# EAGLE design fp2o (EAGLE 5.04)
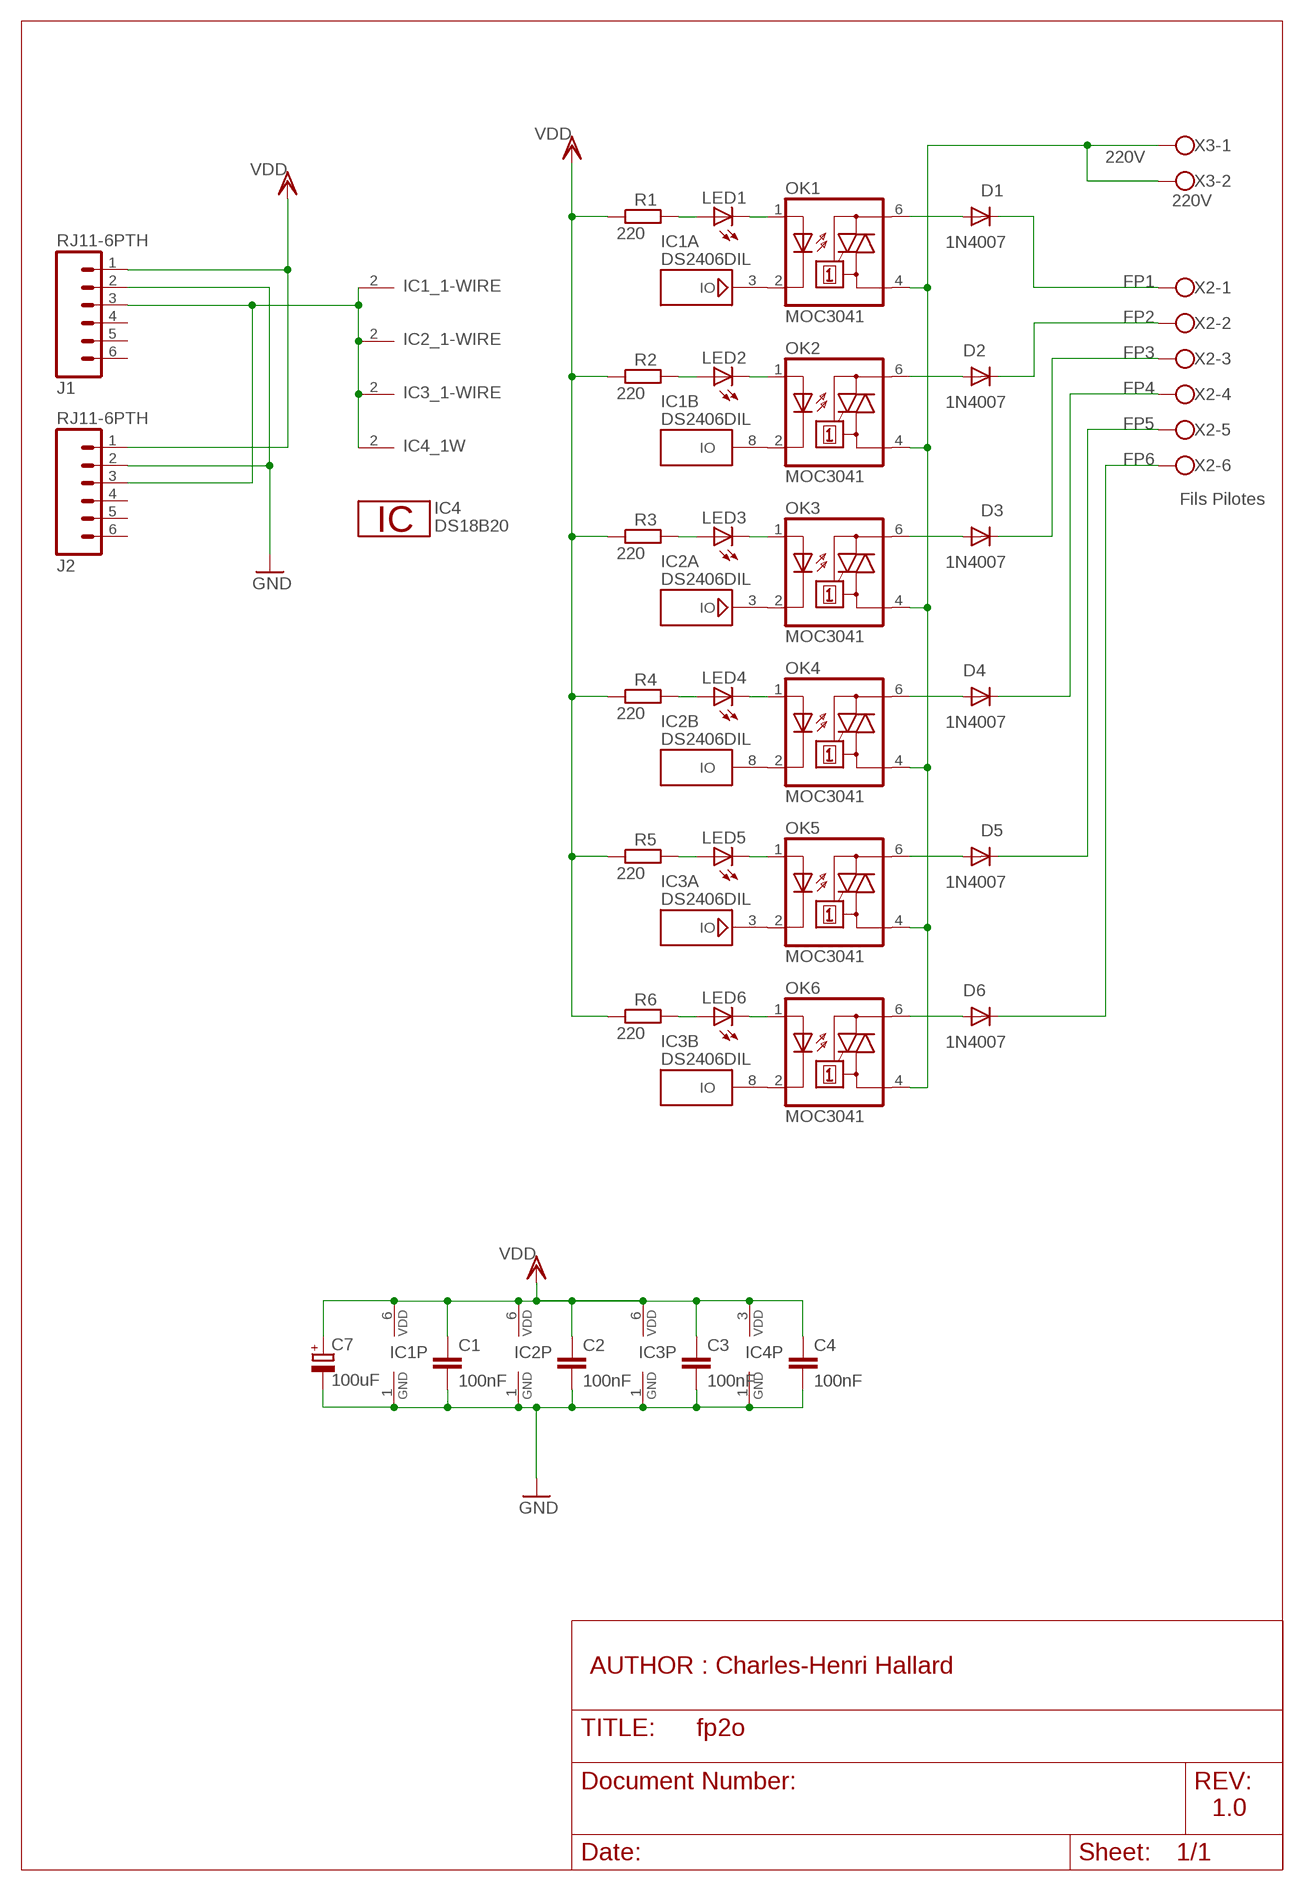
[diagram p0: schematic, sheet 1]

## Parts
C1  100nF  C-EU050-024X044  [C050-024X044]
C2  100nF  C-EU050-024X044  [C050-024X044]
C3  100nF  C-EU050-024X044  [C050-024X044]
C4  100nF  C-EU050-024X044  [C050-024X044]
C7  100uF  CPOL-EUE2,5-6E  [E2,5-6E]
D1  1N4007  1N4004  [DO41-10]
D2  1N4007  1N4004  [DO41-10]
D3  1N4007  1N4004  [DO41-10]
D4  1N4007  1N4004  [DO41-10]
D5  1N4007  1N4004  [DO41-10]
D6  1N4007  1N4004  [DO41-10]
IC1  DS2406DIL  [DIL08]
IC2  DS2406DIL  [DIL08]
IC3  DS2406DIL  [DIL08]
IC4  DS18B20  [TO92-]
J1  RJ11-6PTH  [RJ11-6]
J2  RJ11-6PTH  [RJ11-6]
LED1  LED5MM  [LED5MM]
LED2  LED5MM  [LED5MM]
LED3  LED5MM  [LED5MM]
LED4  LED5MM  [LED5MM]
LED5  LED5MM  [LED5MM]
LED6  LED5MM  [LED5MM]
OK1  MOC3041  MOC3041M  [DIL06]
OK2  MOC3041  MOC3041M  [DIL06]
OK3  MOC3041  MOC3041M  [DIL06]
OK4  MOC3041  MOC3041M  [DIL06]
OK5  MOC3041  MOC3041M  [DIL06]
OK6  MOC3041  MOC3041M  [DIL06]
R1  220  R-EU_0207/10  [0207/10]
R2  220  R-EU_0207/10  [0207/10]
R3  220  R-EU_0207/10  [0207/10]
R4  220  R-EU_0207/10  [0207/10]
R5  220  R-EU_0207/10  [0207/10]
R6  220  R-EU_0207/10  [0207/10]
X2  Fils Pilotes  W237-136  [W237-136]
X3  220V  W237-102  [W237-102]

## Nets
1-WIRE: IC1.2(_1-WIRE:1W) IC2.2(_1-WIRE:1W) IC3.2(_1-WIRE:1W) IC4.2 J1.3 J2.3
220V: OK1.4(A1) OK2.4(A1) OK3.4(A1) OK4.4(A1) OK5.4(A1) OK6.4(A1) X3.1 X3.2
FP1: D1.C X2.1
FP2: D2.C X2.2
FP3: D3.C X2.3
FP4: D4.C X2.4
FP5: D5.C X2.5
FP6: D6.C X2.6
GND: C1.2 C2.2 C3.2 C4.2 C7.- IC1.1(P:GND) IC2.1(P:GND) IC3.1(P:GND) IC4.1 J1.2 J2.2
N$1: LED1.K(C) OK1.1(A)
N$2: LED2.K(C) OK2.1(A)
N$3: LED1.A R1.2
N$4: LED2.A R2.2
N$5: IC1.3(A:IO) OK1.2(C)
N$6: IC1.8(B:IO) OK2.2(C)
N$7: D2.A OK2.6(A2)
N$8: D1.A OK1.6(A2)
N$9: D4.A OK4.6(A2)
N$10: IC2.3(A:IO) OK3.2(C)
N$11: LED3.K(C) OK3.1(A)
N$12: IC2.8(B:IO) OK4.2(C)
N$13: LED4.K(C) OK4.1(A)
N$14: LED3.A R3.2
N$15: LED4.A R4.2
N$16: IC3.3(A:IO) OK5.2(C)
N$17: IC3.8(B:IO) OK6.2(C)
N$18: D6.A OK6.6(A2)
N$19: D3.A OK3.6(A2)
N$23: LED5.K(C) OK5.1(A)
N$24: LED6.K(C) OK6.1(A)
N$25: LED5.A R5.2
N$26: LED6.A R6.2
N$30: D5.A OK5.6(A2)
VDD: C1.1 C2.1 C3.1 C4.1 C7.+ IC1.6(P:VDD) IC2.6(P:VDD) IC3.6(P:VDD) IC4.3 J1.1 J2.1 R1.1 R2.1 R3.1 R4.1 R5.1 R6.1
Unconnected: J1.4 J1.5 J1.6 J2.4 J2.5 J2.6

## Notes on the sheet
- AUTHOR : Charles-Henri Hallard
- 1.0

## Library data of the parts
C1-C4 = resistor:C-EU: CAPACITOR, European symbol
C7 = resistor:CPOL-EU: POLARIZED CAPACITOR, European symbol
D1-D6 = diode:1N4004: DIODE general purpose rectifier, 1 A
IC1-IC3 = _c2h:DS2406: Dual Addressable Switch Plus 1024-Bit EPROM This chip provides one open drain I/O pin (PA) with 50mA sinking capability and a second open drain I/O pin (PB) with 8mA sinking capability. Each I/O pin also feature an edge detector which is set by any level change on the input and reset by software. The EPROM has 4 pages of 256 bit with sparate write protection. Notes: 12V must be applied to the 1W pin in a controlled fashion to program the EPROM. This is handled by e.g. the DS2480B host adapter chip automatically. Vdd@5V may be used to save the current chip state whenever parasitic power over the 1W pin is lost. Vdd is no Vpp pin! Never connect 12V to Vdd. The DS2406 is the same chip in a TO-92 package with 3 pins only, thus missing the PB and Vdd features. Author: Jan Kandziora <jjj@gmx.de>
IC4 = 1wire:DS18B20: Programmable Resolution Digital Thermometer This chip provides a onewire thermosensor with approx. 0.5°C accuracy. A programmable over/undertemperure alarm is available. The precision can be set from 9..12 bits. Notes: Vdd must be applied for accurate measurements at low temperatures, as the parasite power circuit otherwise heats the sensor. If parasite power is used, Vdd has to be connected to GND. The DS1822 is a low-cost thermometer chip, the DS18S20 is similar to the DS18B20, but with 9 Bit precision only. Author: Jan Kandziora <jjj@gmx.de>
J1 J2 = _c2h:RJ11-6: RJ11 Jack Simple 6 pin RJ11 jack. Commonly found on CAT3 devices and Microchip programmers. SKU: PRT-00132
LED1-LED6 = led:LED: LED OSRAM: - CHIPLED LG R971, LG N971, LY N971, LG Q971, LY Q971, LO R971, LY R971 LH N974, LH R974 LS Q976, LO Q976, LY Q976 LO Q996 - Hyper CHIPLED LW Q18S LB Q993, LB Q99A, LB R99A - SideLED LS A670, LO A670, LY A670, LG A670, LP A670 LB A673, LV A673, LT A673, LW A673 LH A674 LY A675 LS A676, LA A676, LO A676, LY A676, LW A676 LS A679, LY A679, LG A679 - Hyper Micro SIDELED® LS Y876, LA Y876, LO Y876, LY Y876 LT Y87S - SmartLED LW L88C, LW L88S LB L89C, LB L89S, LG L890 LS L89K, LO L89K, LY L89K LS L896, LA L896, LO L896, LY L896 - TOPLED LS T670, LO T670, LY T670, LG T670, LP T670 LSG T670, LSP T670, LSY T670, LOP T670, LYG T670 LG T671, LOG T671, LSG T671 LB T673, LV T673, LT T673, LW T673 LH T674 LS T676, LA T676, LO T676, LY T676, LB T676, LH T676, LSB T676, LW T676 LB T67C, LV T67C, LT T67C, LS T67K, LO T67K, LY T67K, LW E67C LS E67B, LA E67B, LO E67B, LY E67B, LB E67C, LV E67C, LT E67C LW T67C LS T679, LY T679, LG T679 LS T770, LO T770, LY T770, LG T770, LP T770 LB T773, LV T773, LT T773, LW T773 LH T774 LS E675, LA E675, LY E675, LS T675 LS T776, LA T776, LO T776, LY T776, LB T776 LHGB T686 LT T68C, LB T68C - Hyper Mini TOPLED® LB M676 - Mini TOPLED Santana® LG M470 LS M47K, LO M47K, LY M47K Source: http://www.osram.convergy.de LUXEON: - LUMILED® LXK2-PW12-R00, LXK2-PW12-S00, LXK2-PW14-U00, LXK2-PW14-V00 LXK2-PM12-R00, LXK2-PM12-S00, LXK2-PM14-U00 LXK2-PE12-Q00, LXK2-PE12-R00, LXK2-PE12-S00, LXK2-PE14-T00, LXK2-PE14-U00 LXK2-PB12-K00, LXK2-PB12-L00, LXK2-PB12-M00, LXK2-PB14-N00, LXK2-PB14-P00, LXK2-PB14-Q00 LXK2-PR12-L00, LXK2-PR12-M00, LXK2-PR14-Q00, LXK2-PR14-R00 LXK2-PD12-Q00, LXK2-PD12-R00, LXK2-PD12-S00 LXK2-PH12-R00, LXK2-PH12-S00 LXK2-PL12-P00, LXK2-PL12-Q00, LXK2-PL12-R00 Source: www.luxeon.com KINGBRIGHT: KA-3528ASYC Source: www.kingbright.com
OK1-OK6 = optocoupler:MOC30*: 6-Pin DIP Zero-Cross Optoisolators Triac Driver Output (250/400 Volt Peak) Source: http://www.fairchildsemi.com/ds/MO/MOC3043-M.pdf
R1-R6 = rcl:R-EU_: RESISTOR, European symbol
X2 = con-wago-500:W237-136: WAGO SCREW CLAMP
X3 = con-wago-500:W237-102: WAGO SCREW CLAMP

## Board
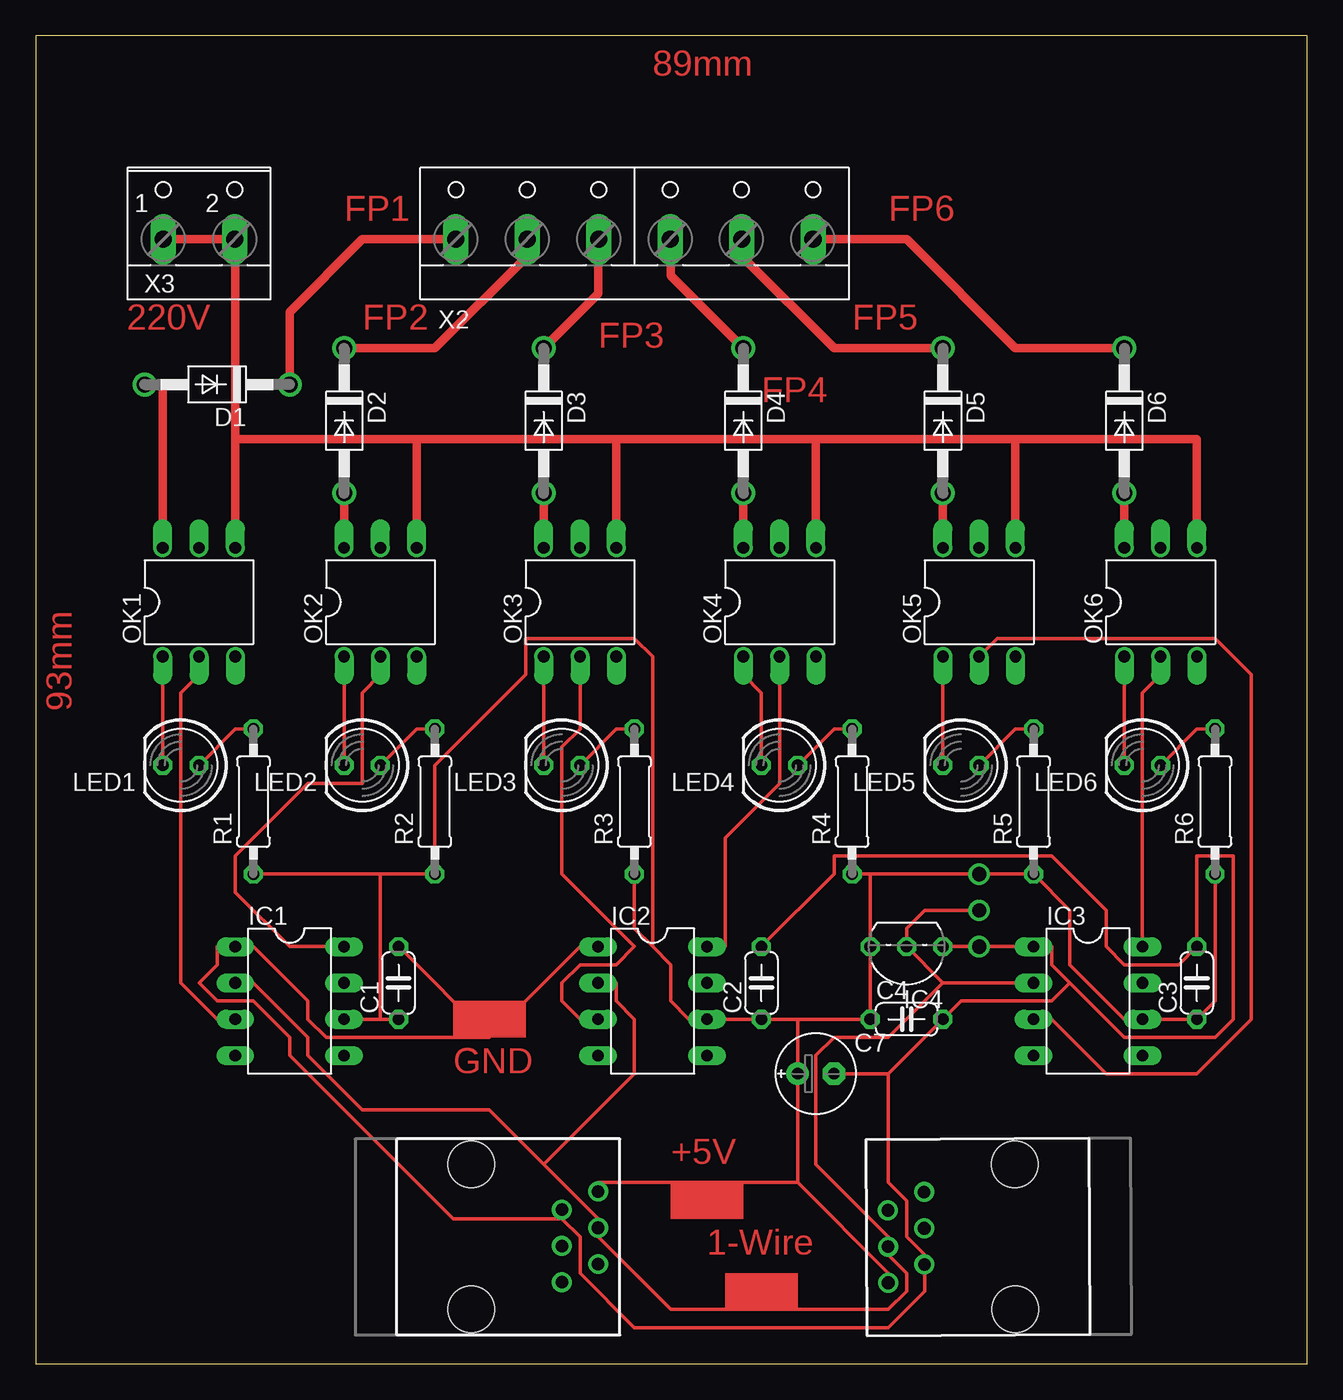
[diagram p1: board, top side]

Size 89 x 93 mm. Coordinates in mm from the lower left corner, seen from the top.
Outline: 0,0 89,0 89,93 0,93 0,0
Copper layers (1*16): Top 0.035mm / dielectric 1.5mm / Bottom 0.035mm
Design rules "default *": minimum track width 10mil, minimum drill 24mil, track to track 8mil, track to pad 8mil, pad to pad 8mil, via to via 8mil, smd to smd 8mil, copper to edge 40mil, drill to drill 8mil, minimum pad ring 10mil, minimum via ring 8mil, stop-mask expansion 4mil, vias tented up to drill 0mil, thermal gap 10mil

### Footprints (pad centres in the part's own frame; a part is rotated, then mirrored left to right if it is on the bottom)
C050-024X044 = drill 0.813 octagon: 1 -2.54,0; 2 2.54,0
E2,5-6E = drill 0.813 pad 1.575 round: + -1.27,0 | drill 0.813 pad 1.575 octagon: - 1.27,0
DO41-10 = drill 1.118 round: A 5.08,0; C -5.08,0
DIL08 = drill 0.813 long: 1 -3.81,-3.81; 2 -1.27,-3.81; 3 1.27,-3.81; 4 3.81,-3.81; 5 3.81,3.81; 6 1.27,3.81; 7 -1.27,3.81; 8 -3.81,3.81
TO92- = drill 0.813 octagon: 1 -2.54,0; 2 0,0; 3 2.54,0
RJ11-6 = drill 0.889 round: 1 1.905,8.89; 2 3.175,6.35; 3 4.445,8.89; 4 5.715,6.35; 5 6.985,8.89; 6 8.255,6.35 | hole 3.251: 0,0; 10.16,0
LED5MM = drill 0.813 octagon: A -1.27,0; K 1.27,0
DIL06 = drill 0.813 offset: 1 -2.54,-3.81; 2 0,-3.81; 3 2.54,-3.81; 4 2.54,3.81; 5 0,3.81; 6 -2.54,3.81
0207/10 = drill 0.813 octagon: 1 -5.08,0; 2 5.08,0
W237-136 = drill 1.194 long: 1 -12.5,-1.27; 2 -7.5,-1.27; 3 -2.5,-1.27; 4 2.5,-1.27; 5 7.5,-1.27; 6 12.5,-1.27
W237-102 = drill 1.194 long: 1 -2.5,-1.27; 2 2.5,-1.27

### Placement (x,y rotation side)
C1  25.4,26.67 90 top
C2  50.8,26.67 90 top
C3  81.28,26.67 90 top
C4  60.96,24.13 0 top
C7  54.61,20.32 0 top
D1  12.7,68.58 180 top
D2  21.59,66.04 270 top
D3  35.56,66.04 270 top
D4  49.53,66.04 270 top
D5  63.5,66.04 270 top
D6  76.2,66.04 270 top
IC1  17.78,25.4 270 top
IC2  43.18,25.4 270 top
IC3  73.66,25.4 270 top
IC4  60.96,29.21 180 top
J1  68.58,3.81 90.3 top
J2  30.48,13.97 270 top
LED1  10.16,41.91 180 top
LED2  22.86,41.91 180 top
LED3  36.83,41.91 180 top
LED4  52.07,41.91 180 top
LED5  64.77,41.91 180 top
LED6  77.47,41.91 180 top
OK1  11.43,53.34 0 top
OK2  24.13,53.34 0 top
OK3  38.1,53.34 0 top
OK4  52.07,53.34 0 top
OK5  66.04,53.34 0 top
OK6  78.74,53.34 0 top
R1  15.24,39.37 90 top
R2  27.94,39.37 90 top
R3  41.91,39.37 90 top
R4  57.15,39.37 90 top
R5  69.85,39.37 90 top
R6  82.55,39.37 90 top
X2  41.91,80.01 0 top
X3  11.43,80.01 0 top

### Tracks (layer width: path | path; a pad name or v marks a point on that pad's centre or on a via)
1-WIRE  (via drill 1 pad 1.27)
  Top 0.254: 63.5,26.67 IC4.2 60.96,30.48 62.23,31.75 v66.04,31.75 | 63.5,26.67 IC3.2 | 63.5,26.67 59.69,22.86 55.88,22.86 54.61,21.59 54.61,13.97 59.69,8.89 J1.3 59.69,7.62 60.96,6.35 60.96,5.08 59.69,3.81 44.45,3.81 39.37,8.89 J2.3 39.37,10.16 35.56,13.97 | 35.56,13.97 31.75,17.78 22.86,17.78 19.05,21.59 19.05,22.86 15.24,26.67 IC1.2 | 35.56,13.97 41.91,20.32 41.91,24.13 40.64,25.4 40.64,26.67 IC2.2
220V
  Top 0.254: OK1.4 13.97,64.77 13.97,77.47 X3.2 | X3.2 X3.1 8.89,78.74 | 13.97,78.74 X3.2
  Top 0.61: 13.97,64.77 26.67,64.77 | 26.67,64.77 40.64,64.77 | 40.64,64.77 54.61,64.77 | 54.61,64.77 68.58,64.77 | 68.58,64.77 81.28,64.77 OK6.4 | 26.67,64.77 OK2.4 | 40.64,64.77 OK3.4 | 54.61,64.77 OK4.4 | 68.58,64.77 OK5.4 | OK1.4 13.97,78.74 8.89,78.74
FP1
  Top 0.254: 29.21,78.74 X2.1
  Top 0.61: D1.C 17.78,73.66 22.86,78.74 29.21,78.74
FP2
  Top 0.254: 34.29,77.47 X2.2
  Top 0.61: D2.C 27.94,71.12 34.29,77.47 34.29,78.74
FP3
  Top 0.254: 39.37,77.47 X2.3
  Top 0.61: D3.C 39.37,74.93 39.37,77.47 39.37,78.74
FP4
  Top 0.254: 44.45,76.2 44.45,77.47 X2.4
  Top 0.61: D4.C 44.45,76.2 44.45,78.74
FP5
  Top 0.254: 49.53,77.47 X2.5
  Top 0.61: D5.C 55.88,71.12 49.53,77.47 49.53,78.74
FP6
  Top 0.254: X2.6 54.61,78.74
  Top 0.61: D6.C 68.58,71.12 60.96,78.74 54.61,78.74
GND
  Top 0.254: C2.2 55.88,34.29 55.88,35.56 71.12,35.56 74.93,31.75 74.93,29.21 76.2,27.94 80.01,27.94 C3.2 81.28,35.56 83.82,35.56 83.82,24.13 82.55,22.86 76.2,22.86 72.39,26.67 | 31.75,22.86 20.32,22.86 19.05,24.13 19.05,25.4 15.24,29.21 IC1.1 12.7,29.21 12.7,27.94 11.43,26.67 12.7,25.4 15.24,25.4 17.78,22.86 17.78,21.59 29.21,10.16 36.83,10.16 | 31.75,22.86 38.1,29.21 IC2.1 | 31.75,22.86 C1.2 | IC4.1 IC3.1 71.12,29.21 71.12,27.94 72.39,26.67 | 59.69,20.32 C4.2 64.77,25.4 71.12,25.4 72.39,26.67 | 59.69,20.32 C7.- | 36.83,10.16 38.1,8.89 38.1,6.35 41.91,2.54 59.69,2.54 62.23,5.08 62.23,6.35 J1.2 62.23,7.62 60.96,8.89 60.96,11.43 59.69,12.7 59.69,20.32 | 36.83,10.16 J2.2
N$1
  Top 0.254: LED1.K OK1.1
N$2
  Top 0.254: LED2.K OK2.1
N$3
  Top 0.254: LED1.A 13.97,44.45 R1.2
N$4
  Top 0.254: LED2.A 26.67,44.45 R2.2
N$5
  Top 0.254: IC1.3 12.7,24.13 10.16,26.67 10.16,46.99 11.43,48.26 OK1.2
N$6
  Top 0.254: IC1.8 17.78,29.21 13.97,33.02 13.97,35.56 19.05,40.64 22.86,40.64 22.86,46.99 24.13,48.26 OK2.2
N$7
  Top 0.254: OK2.6 D2.A
  Top 0.61: OK2.6 D2.A
N$8
  Top 0.61: OK1.6 8.89,68.58 D1.A
N$9
  Top 0.254: OK4.6 D4.A
  Top 0.61: OK4.6 D4.A
N$10
  Top 0.254: OK3.2 38.1,44.45 36.83,43.18 36.83,34.29 41.91,29.21 40.64,27.94 38.1,27.94 36.83,26.67 36.83,25.4 38.1,24.13 IC2.3
N$11
  Top 0.254: LED3.K OK3.1
N$12
  Top 0.254: IC2.8 48.26,29.21 48.26,36.83 52.07,40.64 OK4.2
N$13
  Top 0.254: LED4.K 50.8,46.99 49.53,48.26 OK4.1
N$14
  Top 0.254: LED3.A 40.64,44.45 R3.2
N$15
  Top 0.254: LED4.A 55.88,44.45 R4.2
N$16
  Top 0.254: OK5.2 67.31,50.8 82.55,50.8 85.09,48.26 85.09,24.13 81.28,20.32 74.93,20.32 71.12,24.13 IC3.3
N$17
  Top 0.254: IC3.8 77.47,46.99 78.74,48.26 OK6.2
N$18
  Top 0.254: OK6.6 D6.A
  Top 0.61: OK6.6 D6.A
N$19
  Top 0.254: OK3.6 D3.A
  Top 0.61: OK3.6 D3.A
N$21  (via drill 1)
  other vias: 66.04,29.21
N$23
  Top 0.254: LED5.K OK5.1
N$24
  Top 0.254: LED6.K OK6.1
N$25
  Top 0.254: LED5.A 68.58,44.45 R5.2
N$26
  Top 0.254: LED6.A 81.28,44.45 R6.2
N$27  (via drill 1 pad 1.27)
  other vias: 66.04,34.29
N$30
  Top 0.254: OK5.6 D5.A
  Top 0.61: OK5.6 D5.A
VDD
  Top 0.254: 53.34,12.7 59.69,6.35 J1.1 | 53.34,12.7 C7.+ 53.34,24.13 | 53.34,12.7 39.37,12.7 J2.1 | 24.13,24.13 C1.1 | IC1.6 24.13,24.13 | 24.13,34.29 R2.1 27.94,41.91 34.29,48.26 34.29,50.8 41.91,50.8 43.18,49.53 43.18,29.21 | 24.13,34.29 R1.1 | 24.13,24.13 24.13,34.29 | R3.1 41.91,30.48 43.18,29.21 | 43.18,29.21 44.45,27.94 44.45,25.4 45.72,24.13 IC2.6 C2.1 53.34,24.13 | R6.1 82.55,25.4 C3.1 IC3.6 76.2,24.13 72.39,27.94 72.39,31.75 R5.1 58.42,34.29 | 58.42,34.29 R4.1 | 58.42,34.29 IC4.3 C4.1 53.34,24.13
(copper drawn outside any net)
  shapes: Top area x4

### Text on the board
Top: 89mm | FP1 | FP6 | 220V | FP2 | FP5 | FP3 | FP4 | 93mm | GND | +5V | 1-Wire